# Altium project all_in_a1.PrjPCB
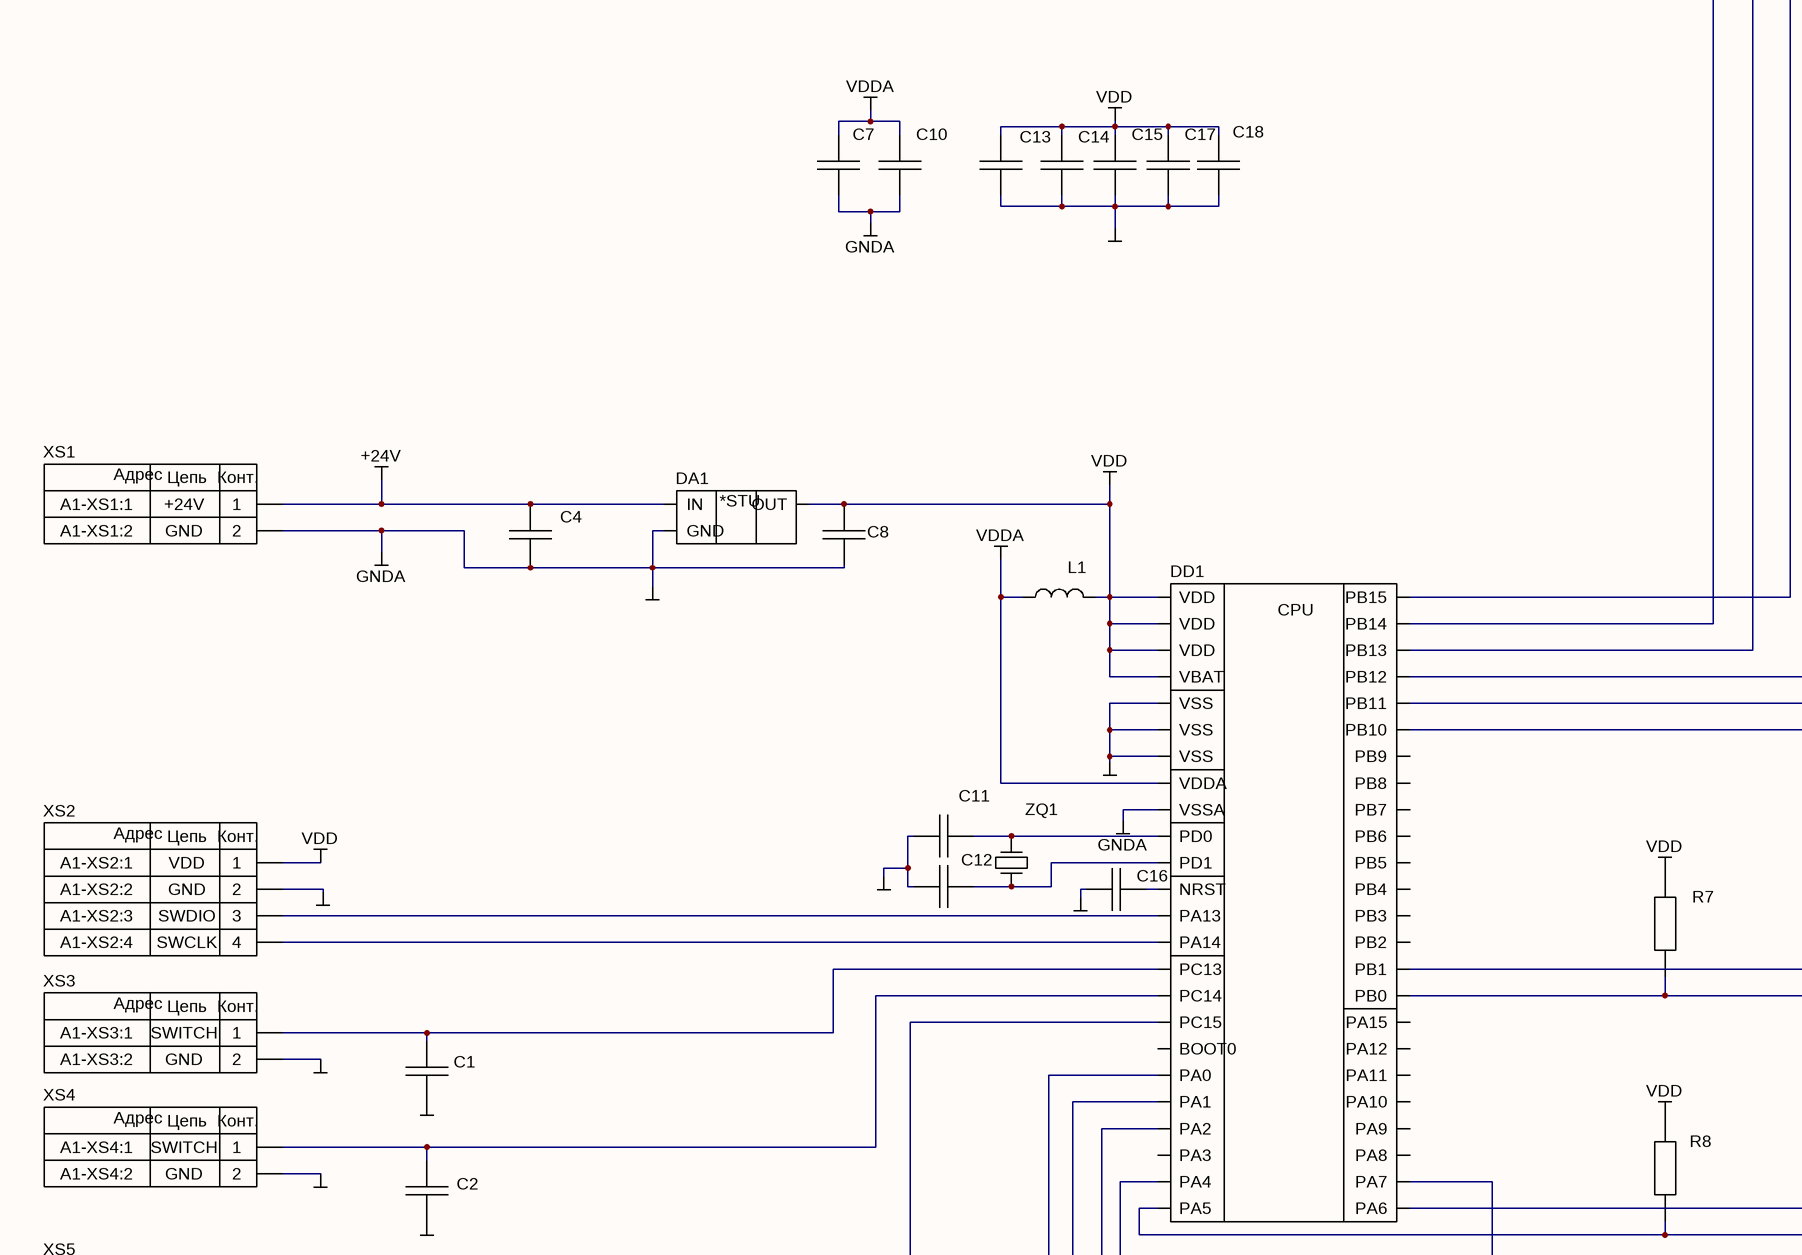
[diagram p0: all_in_a1.SchDoc, top left]
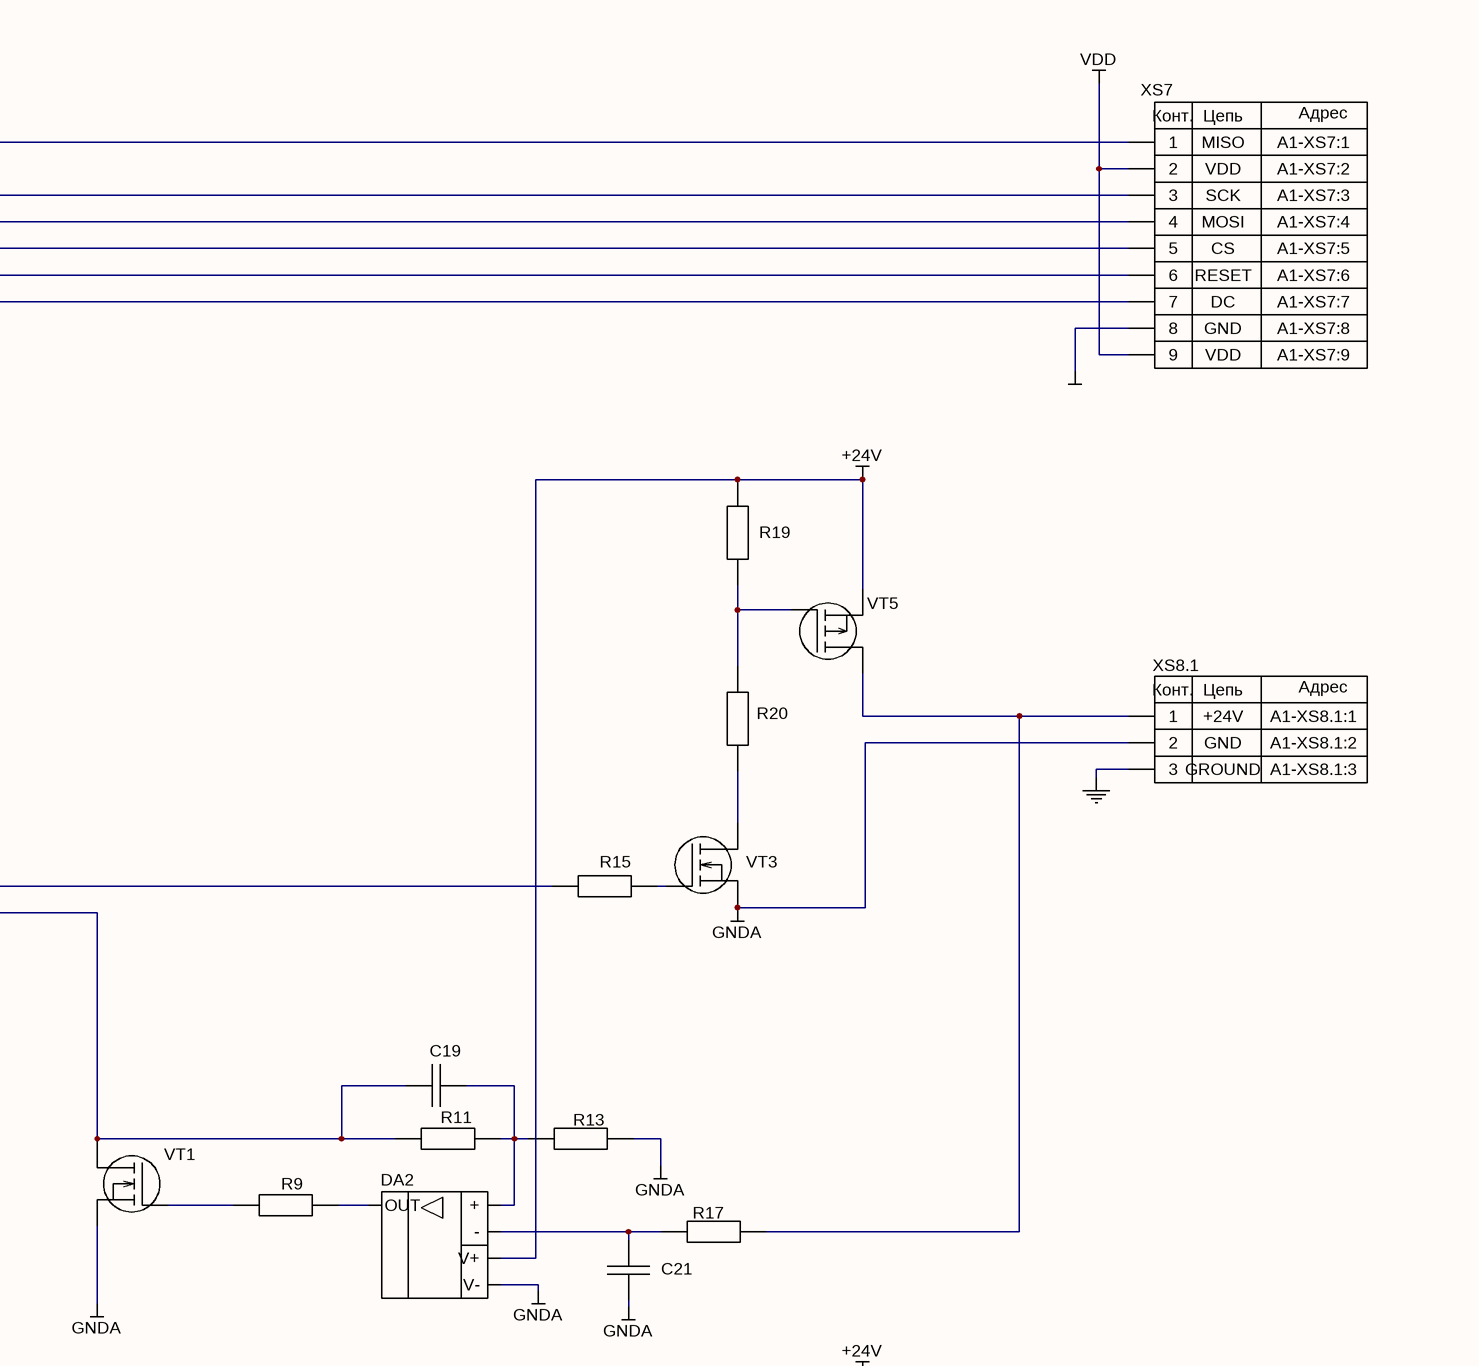
[diagram p1: all_in_a1.SchDoc, top right]
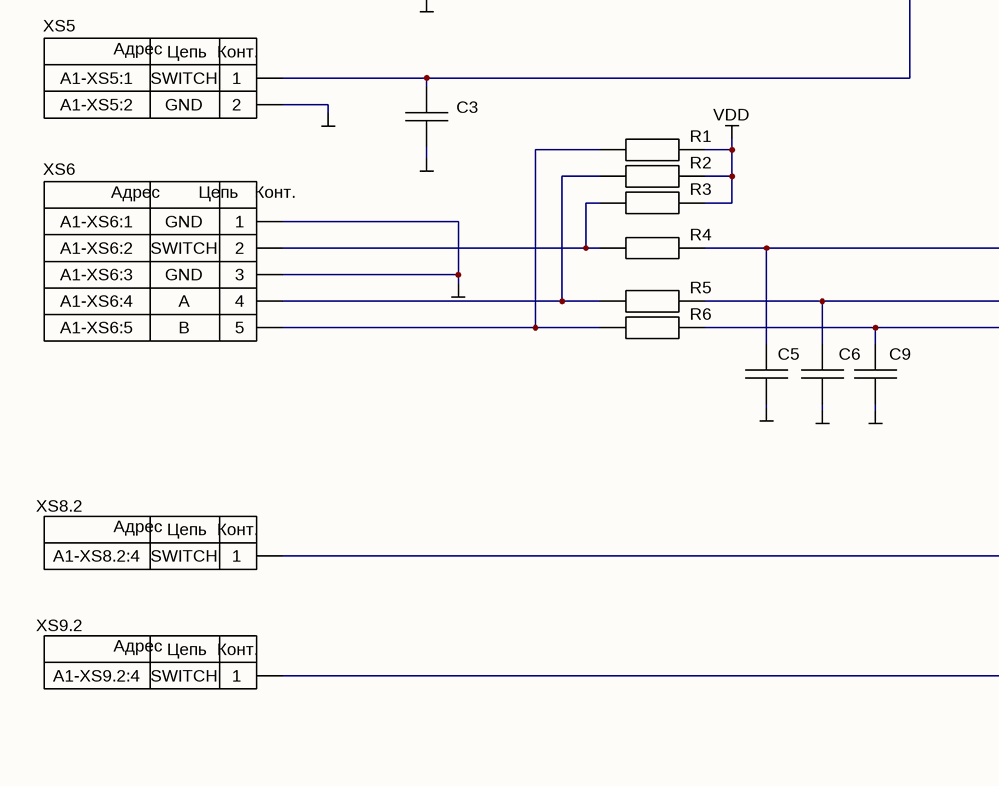
[diagram p2: all_in_a1.SchDoc, bottom left]
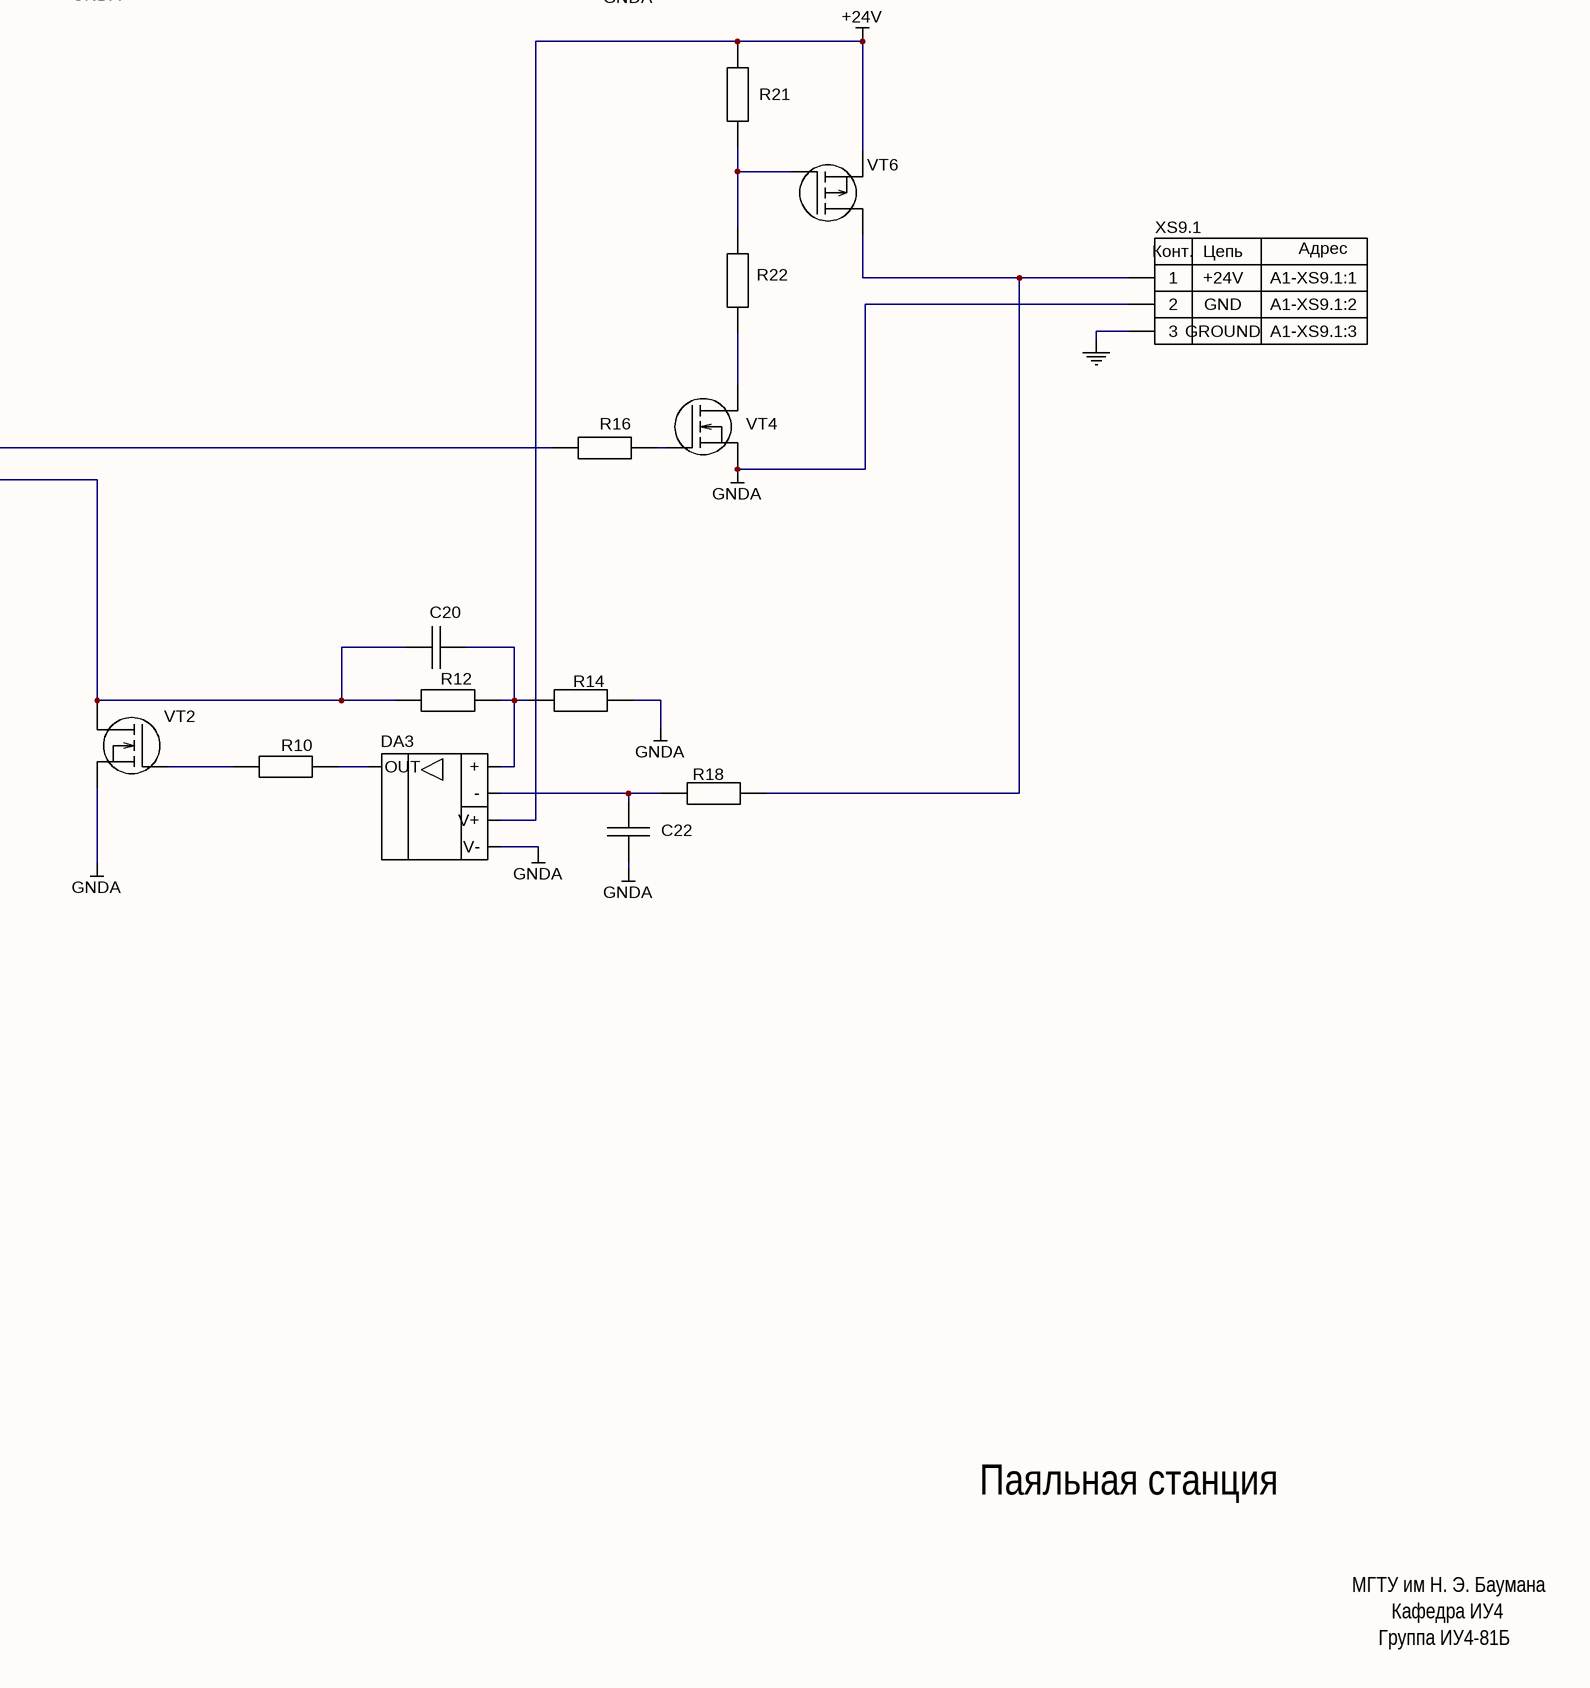
[diagram p3: all_in_a1.SchDoc, bottom right]
1 sheet, 67 parts. Net scope: global (net labels, ports and power ports of the same name join across sheets).

## Sheet all_in_a1.SchDoc
size 839 x 594 mm; CheckedBy: Журавлева Л.В.; Author: Шушуев А.И.; SheetNumber: 1; PageSetup: Record=PageOptions|CenterHorizontal=True|CenterVertical=True|PrintScale=0.94|XCorrection=1.00|YCorrection=1.00|PrintKind=1|BorderSize=5000000|LeftOffset=0|BottomOffset=0|Orientation=1|PaperLength=1000|PaperWidth=1000|Scale=100|PaperSource=7|PrintQuality=-4|MediaType=1|DitherType=10|PaperKind=A4|PrintScaleMode=1; DecimalNumber: ИУ4.11.03.03.21.08.81.17.003 Э3

### Parts
C1  100 нФ  [CAP: 0603]  (value not drawn)
C2  100 нФ  [CAP: 0603]  (value not drawn)
C3  100 нФ  [CAP: 0603]  (value not drawn)
C4  0.330 мкФ  [CAP: 0603]  (value not drawn)
C5  100 нФ  [CAP: 0603]  (value not drawn)
C6  100 нФ  [CAP: 0603]  (value not drawn)
C7  1 мкФ  [CAP: 0603]  (value not drawn)
C8  100 нФ  [CAP: 0603]  (value not drawn)
C9  100 нФ  [CAP: 0603]  (value not drawn)
C10  10 нФ  [CAP: 0603]  (value not drawn)
C11  22 пФ  [CAP: 0603]  (value not drawn)
C12  22 пФ  [CAP: 0603]  (value not drawn)
C13  100 нФ  [CAP: 0603]  (value not drawn)
C14  100 нФ  [CAP: 0603]  (value not drawn)
C15  100 нФ  [CAP: 0603]  (value not drawn)
C16  100 нФ  [CAP: 0603]  (value not drawn)
C17  100 нФ  [CAP: 0603]  (value not drawn)
C18  4.7 мкФ  [CAP: 0603]  (value not drawn)
C19  100 нФ  [CAP: 0603]  (value not drawn)
C20  100 нФ  [CAP: 0603]  (value not drawn)
C21  100 нФ  [CAP: 0603]  (value not drawn)
C22  100 нФ  [CAP: 0603]  (value not drawn)
DA1  78xx  [SOT89]  (value not drawn)
DA2  LMV321ILT  [SOT23-5]  (value not drawn)
DA3  LMV321ILT  [SOT23-5]  (value not drawn)
DD1  STM32F103C8T6  (value not drawn)
L1  10 мкГн  [IND: 0805]  (value not drawn)
R1  Res  [RES: 0603]  (value not drawn)
R2  Res  [RES: 0603]  (value not drawn)
R3  Res  [RES: 0603]  (value not drawn)
R4  Res  [RES: 0603]  (value not drawn)
R5  Res  [RES: 0603]  (value not drawn)
R6  Res  [RES: 0603]  (value not drawn)
R7  Res  [RES: 1206]  (value not drawn)
R8  Res  [RES: 1206]  (value not drawn)
R9  Res  [RES: 0603]  (value not drawn)
R10  Res  [RES: 0603]  (value not drawn)
R11  Res  [RES: 0603]  (value not drawn)
R12  Res  [RES: 0603]  (value not drawn)
R13  Res  [RES: 0603]  (value not drawn)
R14  Res  [RES: 0603]  (value not drawn)
R15  Res  [RES: 0603]  (value not drawn)
R16  Res  [RES: 0603]  (value not drawn)
R17  Res  [RES: 0603]  (value not drawn)
R18  Res  [RES: 0603]  (value not drawn)
R19  Res  [RES: 1206]  (value not drawn)
R20  Res  [RES: 1206]  (value not drawn)
R21  Res  [RES: 1206]  (value not drawn)
R22  Res  [RES: 1206]  (value not drawn)
VT1  FDV303N  [SOT23]  (value not drawn)
VT2  FDV303N  [SOT23]  (value not drawn)
VT3  FDV303N  [SOT23]  (value not drawn)
VT4  FDV303N  [SOT23]  (value not drawn)
VT5  p-mosfet  [DPAK]  (value not drawn)
VT6  p-mosfet  [DPAK]  (value not drawn)
XS1  circuit2: GND  circuit1: +24V  =address2: A1-XS1:2  =address1: A1-XS1:1  [CON: WF-02]  (hidden comment: X2)
XS2  circuit2: GND  circuit3: SWDIO  circuit1: VDD  circuit4: SWCLK  =address4: A1-XS2:4  =address3: A1-XS2:3  =address2: A1-XS2:2  =address1: A1-XS2:1  [CON: WF-04]  (hidden comment: X4)
XS3  circuit2: GND  circuit1: SWITCH  =address2: A1-XS3:2  =address1: A1-XS3:1  [CON: WF-02]  (hidden comment: X2)
XS4  circuit2: GND  circuit1: SWITCH  =address2: A1-XS4:2  =address1: A1-XS4:1  [CON: WF-02]  (hidden comment: X2)
XS5  circuit2: GND  circuit1: SWITCH  =address2: A1-XS5:2  =address1: A1-XS5:1  [CON: WF-02]  (hidden comment: X2)
XS6  cirtuit5: B  circuit4: A  circuit3: GND  circuit2: SWITCH  =address5: A1-XS6:5  =address4: A1-XS6:4  =address3: A1-XS6:3  =address2: A1-XS6:2  =address1: A1-XS6:1  [CON: CWF-5]  (hidden comment: X5)
XS7  circtuit9: VDD  circtuit8: GND  circtuit7: DC  circtuit6: RESET  circtuit5: CS  circtuit4: MOSI  circtuit3: SCK  circtuit1: MISO  =address9: A1-XS7:9  =address8: A1-XS7:8  =address7: A1-XS7:7  =address5: A1-XS7:5  =address6: A1-XS7:6  =address4: A1-XS7:4  =address3: A1-XS7:3  =address2: A1-XS7:2  =address1: A1-XS7:1  [CON: IDC-10MS]  (hidden comment: X9)
XS8.1  circuit1: +24V  circuit2: GND  circuit3: GROUND  =address1: A1-XS8.1:1  =address2: A1-XS8.1:2  =address3: A1-XS8.1:3  (hidden comment: X3)
XS8.2  address: A1-XS8.2:4  circuit: SWITCH  (hidden comment: X1)
XS9.1  circuit1: +24V  circuit2: GND  circuit3: GROUND  =address1: A1-XS9.1:1  =address2: A1-XS9.1:2  =address3: A1-XS9.1:3  (hidden comment: X3)
XS9.2  address: A1-XS9.2:4  circuit: SWITCH  (hidden comment: X1)
ZQ1  AT-41CD2-8MHz  [AT-41CD2]  (value not drawn)

### Nets
+24V: C4.2 DA1.1(IN) DA2.5(V+) DA3.5(V+) R19.2 R21.2 VT5.3 VT6.3 XS1.1
GND: C1.1 C2.1 C3.1 C4.1 C5.1 C6.1 C7.1 C8.1 C9.1 C10.1 C11.1 C12.1 C13.1 C14.1 C15.1 C16.1 C17.1 C18.1 C21.1 C22.1 DA1.3(GND) DA2.2(V-) DA3.2(V-) DD1.8(VSSA) DD1.23(VSS) DD1.35(VSS) DD1.47(VSS) R13.2 R14.2 VT1.3 VT2.3 VT3.3 VT4.3 XS1.2 XS2.2 XS3.2 XS4.2 XS5.2 XS6.1 XS6.3 XS7.8 XS8.1.2 XS9.1.2  [also labelled GNDA]
GROUND: XS8.1.3 XS9.1.3
VDD: C8.2 C13.2 C14.2 C15.2 C17.2 C18.2 DA1.2(OUT) DD1.1(VBAT) DD1.24(VDD) DD1.36(VDD) DD1.48(VDD) L1.2 R1.2 R2.2 R3.2 R7.2 R8.2 XS2.1 XS7.2 XS7.9
VDDA: C7.2 C10.2 DD1.9(VDDA) L1.1
NetC1_2: C1.2 DD1.2(PC13) XS3.1
NetC2_2: C2.2 DD1.3(PC14) XS4.1
NetC3_2: C3.2 DD1.4(PC15) XS5.1
NetC5_2: C5.2 DD1.10(PA0) R4.2
NetC6_2: C6.2 DD1.11(PA1) R5.2
NetC9_2: C9.2 DD1.12(PA2) R6.2
NetC11_2: C11.2 DD1.5(PD0) ZQ1.2
NetC12_2: C12.2 DD1.6(PD1) ZQ1.1
NetC16_2: C16.2 DD1.7(NRST)
NetC19_1: C19.1 DA2.1(+) R11.2 R13.1
NetC19_2: C19.2 DD1.18(PB0) R7.1 R11.1 VT1.2
NetC20_1: C20.1 DA3.1(+) R12.2 R14.1
NetC20_2: C20.2 DD1.15(PA5) R8.1 R12.1 VT2.2
NetC21_2: C21.2 DA2.3(-) R17.1
NetC22_2: C22.2 DA3.3(-) R18.1
NetDA2_4: DA2.4(OUT) R9.2
NetDA3_4: DA3.4(OUT) R10.2
NetDD1_14: DD1.14(PA4) XS8.2.1
NetDD1_16: DD1.16(PA6) R16.1
NetDD1_17: DD1.17(PA7) XS9.2.1
NetDD1_19: DD1.19(PB1) R15.1
NetDD1_21: DD1.21(PB10) XS7.7
NetDD1_22: DD1.22(PB11) XS7.6
NetDD1_25: DD1.25(PB12) XS7.5
NetDD1_26: DD1.26(PB13) XS7.3
NetDD1_27: DD1.27(PB14) XS7.1
NetDD1_28: DD1.28(PB15) XS7.4
NetDD1_34: DD1.34(PA13) XS2.3
NetDD1_37: DD1.37(PA14) XS2.4
NetR1_1: R1.1 R6.1 XS6.5
NetR2_1: R2.1 R5.1 XS6.4
NetR3_1: R3.1 R4.1 XS6.2
NetR9_1: R9.1 VT1.1
NetR10_1: R10.1 VT2.1
NetR15_2: R15.2 VT3.1
NetR16_2: R16.2 VT4.1
NetR17_2: R17.2 VT5.2 XS8.1.1
NetR18_2: R18.2 VT6.2 XS9.1.1
NetR19_1: R19.1 R20.2 VT5.1
NetR20_1: R20.1 VT3.2
NetR21_1: R21.1 R22.2 VT6.1
NetR22_1: R22.1 VT4.2

Not connected (* = marked no-connect by the designer): DD1 13(PA3) 20(PB2) 29(PA8) 30(PA9) 31(PA10) 32(PA11) 33(PA12) 38(PA15) 39(PB3) 40(PB4) 41(PB5) 42(PB6) 43(PB7) 44(BOOT0) 45(PB8) 46(PB9)

### Notes on the sheet
- Паяльная станция
- МГТУ им Н. Э. Баумана
- Кафедра ИУ4
- Группа ИУ4-81Б
- Перв.примен.
- Справ.№
- Подп. и дата
- Инв.№ дубл.
- Взам.инв.№
- Подп.и дата
- Разраб.
- Изм.
- Лист
- № докум.
- Подп.
- Дата
- Лит.
- Масштаб
- Масса
- Т.контр.
- Пров.
- СХЕМА   ЭЛЕКТРИЧЕСКАЯ
- ПРИНЦИПИАЛЬНАЯ
- Листов
- Инв.№ подл.
- Утв.
- Н.контр.
- Нач.сект.
- Формат  A1
- (in symbol 78xx) *STU
- (in symbol STM32F103C8T6) CPU
- (in symbol X1) Цепь; Конт.; Адрес
- (in symbol X2) Цепь; Конт.; Адрес
- (in symbol X3) Конт.; Цепь; Адрес
- (in symbol X4) Цепь; Конт.; Адрес
- (in symbol X5) Адрес; Цепь; Конт.
- (in symbol X9) Конт.; Цепь; Адрес

### Library data of the parts
C1-C22 = C_const
DA1 = 78xx: pin to pad: 1>3 2>1 3>2
DA2 DA3 = single_channel_op_amp: pin to pad: 1>3 3>4 4>1
L1 = L
VT1-VT4 = n-mosfet: pin to pad: 2>3 3>2
ZQ1 = ZQ
XS6 = X5: circuit1: GND
XS7 = X9: circtuit2: VDD